# EasyEDA Pro project 四轮车板子.epro, board PCB2
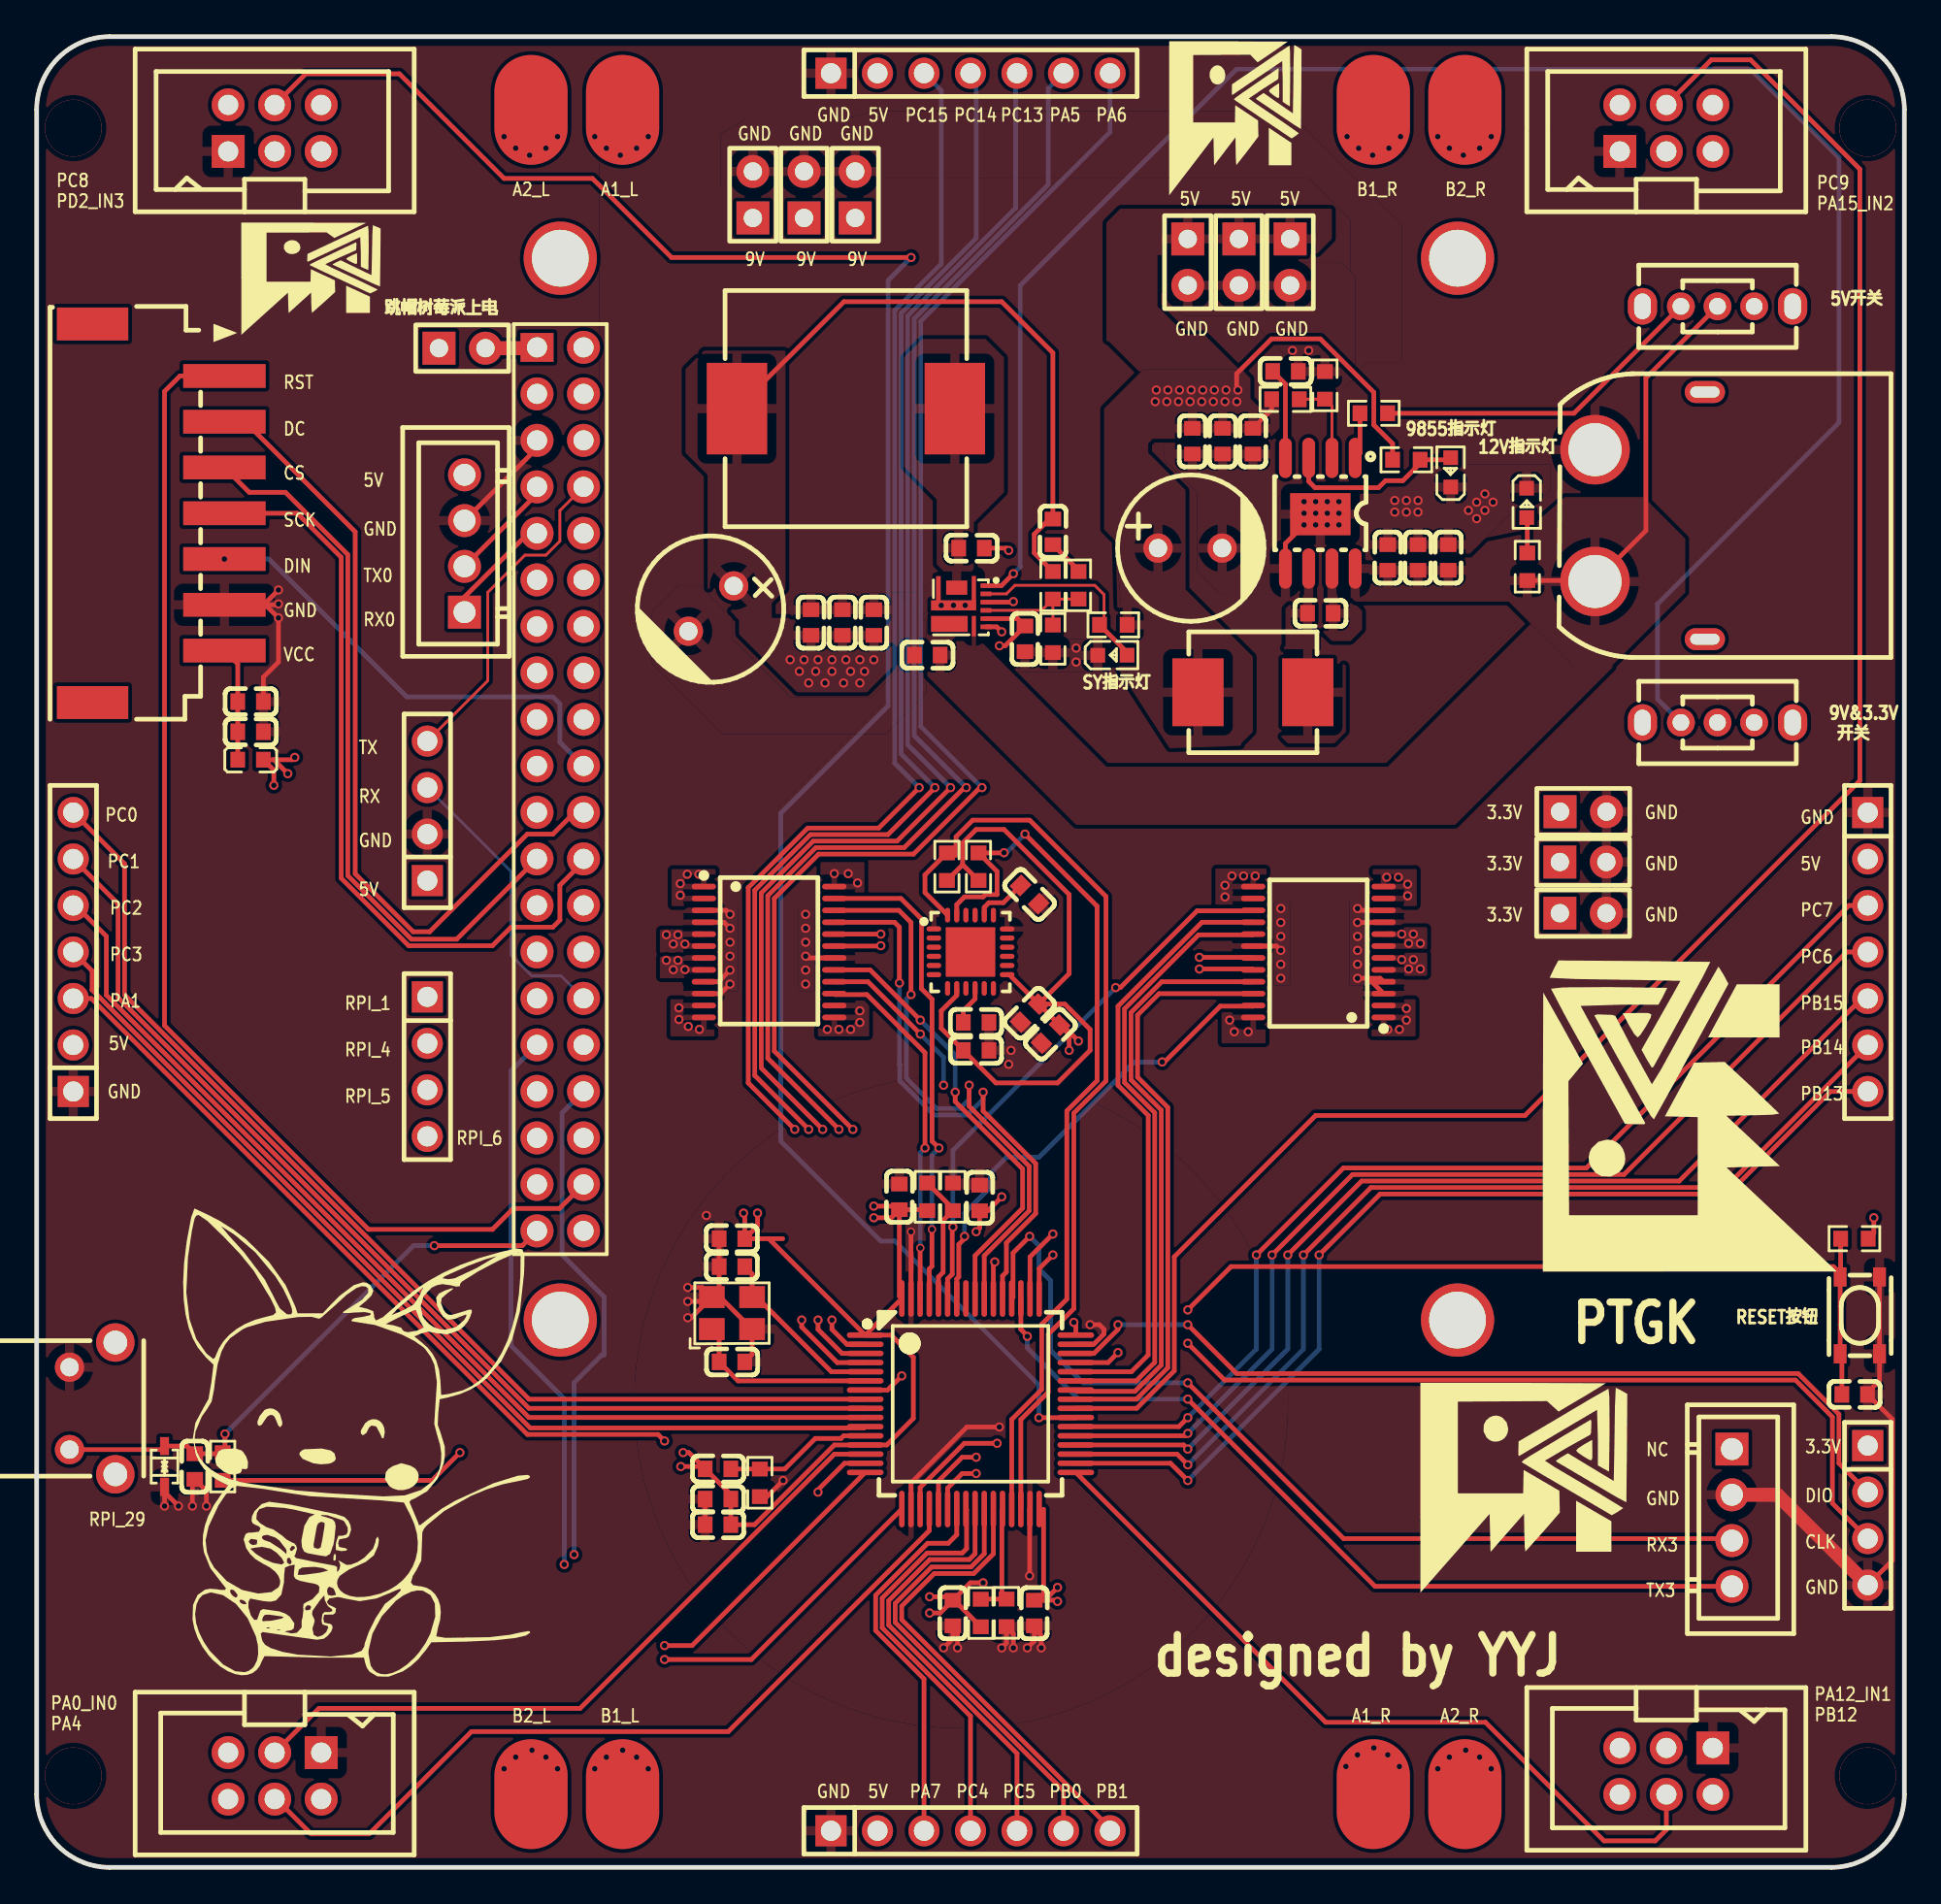
[diagram p10: board, top side]
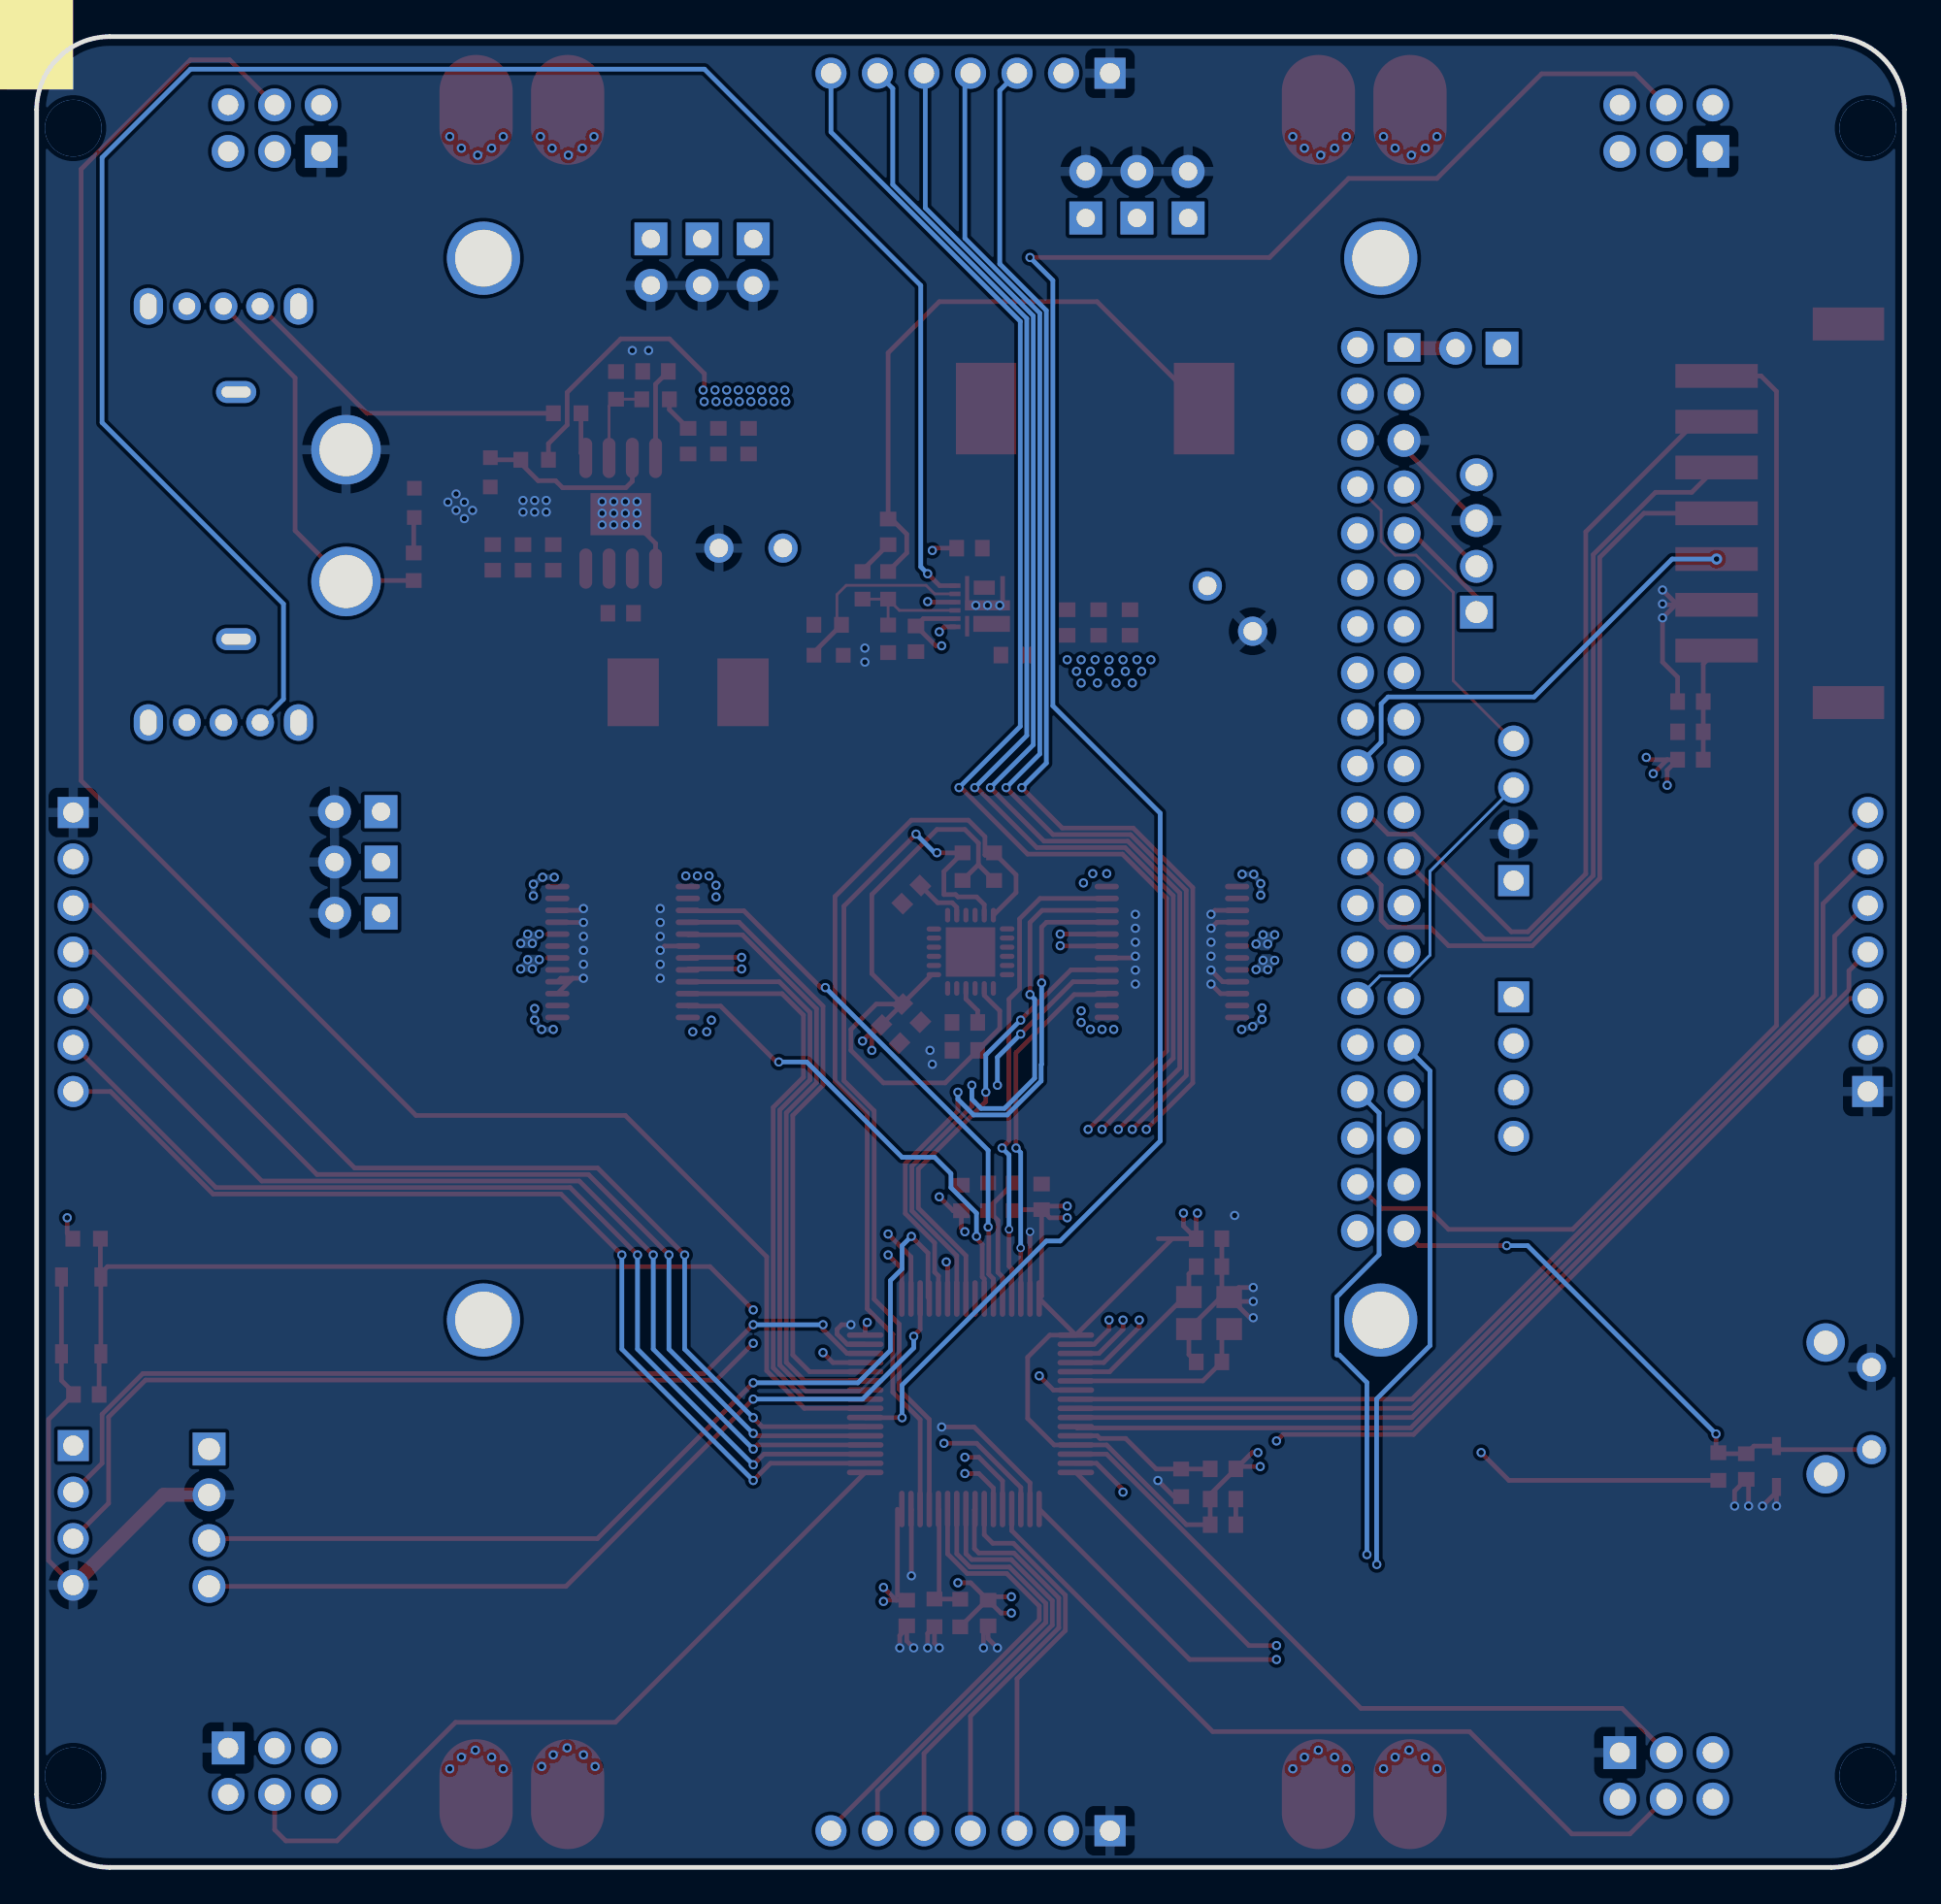
[diagram p11: board, bottom side, seen from below]

Outline 102 x 100 mm; copper layers: Top Layer, Inner1, Inner2, Bottom Layer. Coordinates in mm from the lower left corner of the outline.
Outline path: 0,96 0,4 arc(1.17,1.17) 4,0 98,0 arc(100.83,1.17) 102,4 102,96 arc(100.83,98.83) 98,100 4,100 arc(1.17,98.83) 0,96
Stack: Top Layer 0.035mm / Dielectric1 0.48mm PP er 4.5 / Inner1 0.035mm / Dielectric2 0.48mm FR4 er 4.5 / Inner2 0.035mm / Dielectric3 0.48mm PP er 4.5 / Bottom Layer 0.035mm

## Design rules (mm)
template: 自定义配置
spacing copperThickness1oz (default): track to track 0.102, other pairs 0.152 to 0.3
spacing copperThickness2oz: track to track 0.203, other pairs 0.152 to 0.3
track width copperThickness1oz (default): min 0.127, default 0.254, max 2.54
track width copperThickness2oz: min 0.203, default 0.254, max 2.54
differential pair differentialPair (default): width min 0.127, default 0.254, max 2.54; gap min 0.152, default 0.152
via viaSize (default): diameter min 0.45, default 0.61, max 10; hole min 0.3, default 0.305, max 6.3

## Placement (name value [footprint] x y rotation side)
C7  0.1u  [C0603]  8.64 21.9 90 top
C9  100nF  [C0603]  68.2 81.71 180 top
C10  22uF  [C0603]  75.44 71.55 90 top
C11  22uF  [C0603]  77.09 71.55 90 top
C12  100nF  [C0603]  73.79 71.55 90 top
C13  100nF  [C0603]  70.1 68.5 180 top
C15  22uF  [C0603]  64.77 77.9 90 top
C16  22uF  [C0603]  66.42 77.9 90 top
C17  0.1uF  [C0603]  63.12 77.9 90 top
C18  2.2μF  [C0603]  53.97 67.11 90 top
C19  10μF  [C0603]  48.64 66.22 180 top
C20  100nF  [C0603]  51.05 72.06 180 top
C21  220pF  [C0603]  55.5 72.95 270 top
C22  22μF  [C0603]  42.29 68 90 top
C23  22μF  [C0603]  45.72 68 90 top
C24  22μF  [C0603]  44 68 90 top
C26  220uF  [CAP-TH_BD8.0-P3.50-D0.6-FD]  36.83 68.76 225 top
C27  220uF  [CAP-TH_BD8.0-P3.50-D0.6-FD]  62.99 72.06 0 top
C29  100n  [C0603]  11.68 62.03 180 top
C30  10u  [C0603]  11.68 63.68 180 top
C31  100nF  [C0603]  51.31 44.63 0 top
C32  100nF  [C0603]  51.31 46.15 0 top
C33  2.2uF  [C0603]  54.23 53.14 315 top
C34  2.2uF  [C0603]  55.37 45.52 45 top
C35  100nF  [C0603]  54.23 46.66 45 top
C43  0.1u  [C0603]  37.97 34.34 0 top
C44  0.1u  [C0603]  50.04 13.89 90 top
C45  0.1u  [C0603]  54.48 13.89 90 top
C46  0.1u  [C0603]  51.5 36.56 270 top
C47  0.1u  [C0603]  47.12 36.63 270 top
C51  0.1u  [C0603]  99.29 25.83 0 top
C52  10p  [C0603]  37.97 32.82 0 top
C53  10p  [C0603]  37.97 27.61 180 top
C56  0.1u  [C0603]  37.21 21.77 180 top
C57  100nF  [C0603]  37.21 18.72 180 top
C58  10u  [C0603]  37.21 20.12 180 top
CN1  X8821WRS-07-9TSN  [CONN-SMD_X8821WRS-07-9TSN]  6.66 73.97 270 top
CN2  XT60PW-M  [CONN-TH_XT60PW-M]  88.1 73.84 180 top
CN3  XH-4A  [CONN-TH_4P-P2.50_XH-4A]  23.37 72.31 90 top
CN4  BH254V-6P  [IDC-TH_6P-P2.54-V-R2-C3-S2.54]  13 95 0 top
CN5  BH254V-6P  [IDC-TH_6P-P2.54-V-R2-C3-S2.54]  13 5 180 top
CN6  BH254V-6P  [IDC-TH_6P-P2.54-V-R2-C3-S2.54]  89 95 0 top
CN7  BH254V-6P  [IDC-TH_6P-P2.54-V-R2-C3-S2.54]  89 5.25 180 top
CN8  XH-4A  [CONN-TH_4P-P2.50_XH-4A]  92.58 19.1 270 top
D1  SD03C  [SOD-323_L1.8-W1.3-LS2.5-BI]  6.98 21.9 270 top
H1  -  [HDR-TH_2P-P2.54-V-M-1]  62.87 87.68 270 top
H2  -  [HDR-TH_2P-P2.54-V-M-1]  65.66 87.68 270 top
H3  -  [HDR-TH_2P-P2.54-V-M-1]  68.45 87.68 270 top
H4  -  [HDR-TH_2P-P2.54-V-M-1]  84.46 57.67 0 top
H5  -  [HDR-TH_2P-P2.54-V-M-1]  84.46 54.92 0 top
H6  -  [HDR-TH_2P-P2.54-V-M-1]  84.46 52.12 0 top
H7  2.54mm2*20P直排针  [HDR-TH_40P-P2.54-V-M-R2-C20-S2.54]  28.6 58.9 270 top
H8  -  [HDR-TH_2P-P2.54-V-M-1]  39.12 91.36 90 top
H9  -  [HDR-TH_2P-P2.54-V-M-1]  41.91 91.36 90 top
H10  -  [HDR-TH_2P-P2.54-V-M-1]  44.7 91.36 90 top
H24  -  [HDR-TH_7P-P2.54-V-M]  51 98 0 top
H25  -  [HDR-TH_7P-P2.54-V-M]  2 50 90 top
H26  -  [HDR-TH_7P-P2.54-V-M]  100 50 270 top
H27  -  [HDR-TH_7P-P2.54-V-M]  51 2 0 top
H28  -  [HDR-TH_2P-P2.54-V-M-1]  23.24 82.98 0 top
H29  -  [HDR-TH_4P-P2.54-V-M]  100 19.23 270 top
H30  -  [HDR-TH_4P-P2.54-V-M]  21.34 43.74 270 top
L1  3.3uH  [IND-SMD_L7.0-W6.6]  66.42 64.19 180 top
L2  1.5uH  [IND-SMD_L13.2-W12.9]  44.2 79.68 0 top
L4  600Ω  [L0603]  11.68 60.5 180 top
LED1  -  [LED_0603]  77.22 76.25 90 top
LED2  -  [LED_0603]  58.8 66.22 0 top
LED4  -  [LED_0603]  81.38 74.48 270 top
NOREF  -  [Pad_e91]  77.6 87.9 180 top
NOREF#2  -  [Pad_e93]  28.6 29.9 90 top
NOREF#3  -  [Pad_e46]  32 96 90 top
NOREF#4  -  [Pad_e45]  73 96 90 top
NOREF#5  -  [Pad_e41]  27 4 90 top
NOREF#6  -  [Pad_e47]  27 96 90 top
NOREF#7  -  [Pad_e95]  77.6 29.9 270 top
NOREF#8  -  [Pad_e42]  32 4 90 top
NOREF#9  -  [Pad_e40]  78 4 90 top
NOREF#10  -  [Pad_e38]  73 4 90 top
NOREF#11  -  [Pad_e89]  28.6 87.9 270 top
NOREF#12  -  [Pad_e44]  78 96 90 top
R7  100K  [R0603]  73.03 79.43 180 top
R8  118K  [R0603]  68.2 80.19 180 top
R9  20.5K  [R0603]  70.36 80.95 270 top
R10  4.7K  [R0603]  74.8 76.89 0 top
R11  4.7K  [R0603]  51.44 54.66 270 top
R12  0  [R0603]  39.5 21.01 270 top
R13  4.7K  [R0603]  58.8 67.87 180 top
R14  1K  [R0603]  56.9 70.03 270 top
R15  140K  [R0603]  55.5 70.03 270 top
R16  10K  [R0603]  55.5 67.11 270 top
R22  10k  [R0603]  10.16 21.9 270 top
R23  4.7K  [R0603]  49.71 54.66 270 top
R24  10K  [R0603]  81.41 71.04 90 top
R52  10k  [R0603]  99.27 34.34 180 top
R57  NC  [R0603]  48.64 36.63 270 top
R58  NC  [R0603]  51.56 13.89 270 top
R59  10k  [R0603]  50.04 36.63 270 top
R60  10k  [R0603]  52.97 13.9 90 top
SW9  KAN0637-0701B  [SW-TH_KAN0637-0701B]  3.05 25.07 270 top
SW10  SS12D07L3B  [SW-TH_SS-12D07-X-X]  91.8 62.53 180 top
SW11  SS12D07L3B  [SW-TH_SS-12D07-X-X]  91.8 85.27 180 top
SW12  -  [SW-SMD_4P-L4.2-W3.4-P2.15-LS4.5-TL]  99.57 30.15 270 top
U3  STM32F103RCT6  [LQFP-64_L10.0-W10.0-P0.50-LS12.0-BL]  51 25.32 270 top
U5  FR9855SP  [SOIC-8_L4.9-W3.9-P1.27-LS6.0-BL-EP3.3]  70.1 73.97 180 top
U6  SY8368QNC  [QFN-10_L3.0-W3.0-P0.45-TL_SILERGY]  50.55 68.89 270 top
U9  TB6612FNG,C,8,EL  [SSOP-24_L8.3-W5.6-P0.65-LS7.6-BL]  40 50 270 top
U10  MPU-6050  [QFN-24_L4.0-W4.0-P0.50-BL-EP2.7]  51 50.01 270 top
U11  TB6612FNG,C,8,EL  [SSOP-24_L8.3-W5.6-P0.65-LS7.6-BL]  70 50 90 top
UART1  -  [HDR-TH_4P-P2.54-V-F]  21.34 57.71 90 top
X2  8MHz  [OSC-SMD_4P-L3.2-W2.5-BL]  37.97 30.28 0 top

## Footprints (pads in the part's own frame, mm; a bottom-side part is the same pattern mirrored in y, then rotated)
C0603
  rect 0.8x0.9 smd: 1(-0.7,0) 2(0.7,0)
CAP-TH_BD8.0-P3.50-D0.6-FD
  round 1.6 hole 1: 1(-1.75,0) 2(1.75,0)
CONN-SMD_X8821WRS-07-9TSN
  rect 1.3x4.5 smd: 1(-7.5,3.6) 2(-5,3.6) 3(-2.5,3.6) 4(0,3.6) 5(2.5,3.6) 6(5,3.6) 7(7.5,3.6)
  rect 1.8x3.9 smd: 8(10.34,-3.6) 9(-10.34,-3.6)
CONN-TH_4P-P2.50_XH-4A
  rect 1.8x1.8 hole 1.199: 1(-3.751,0)
  round 1.8 hole 1.199: 2(-1.25,0) 3(1.25,0) 4(3.751,0)
CONN-TH_XT60PW-M
  round 3.8 hole 2.9: 1(3,-3.6) 2(3,3.6)
  oval 2.2x1.2 hole 1.6x0.6: 3(-3,6.75) 4(-3,-6.75)
HDR-TH_2P-P2.54-V-M-1
  rect 1.8x1.8 hole 1: 1(-1.27,0)
  round 1.8 hole 1: 2(1.27,0)
HDR-TH_4P-P2.54-V-F
  rect 1.7x1.7 hole 1.1: 1(-3.81,0)
  round 1.7 hole 1.1: 2(-1.27,0) 3(1.27,0) 4(3.81,0)
HDR-TH_4P-P2.54-V-M
  rect 1.7x1.7 hole 1.1: 1(-3.81,0)
  round 1.7 hole 1.1: 2(-1.27,0) 3(1.27,0) 4(3.81,0)
HDR-TH_7P-P2.54-V-M
  rect 1.7x1.7 hole 1.1: 1(-7.62,0)
  round 1.7 hole 1.1: 2(-5.08,0) 3(-2.54,0) 4(0,0) 5(2.54,0) 6(5.08,0) 7(7.62,0)
HDR-TH_40P-P2.54-V-M-R2-C20-S2.54
  rect 1.575x1.8 hole 1.1: 1(-24.13,-1.27)
  round 1.8 hole 1.1: 2(-24.13,1.27) 3(-21.59,-1.27) 4(-21.59,1.27) 5(-19.05,-1.27) 6(-19.05,1.27) 7(-16.51,-1.27) 8(-16.51,1.27) 9(-13.97,-1.27) 10(-13.97,1.27) 11(-11.43,-1.27) 12(-11.43,1.27) 13(-8.89,-1.27) 14(-8.89,1.27) 15(-6.35,-1.27) 16(-6.35,1.27) 17(-3.81,-1.27) 18(-3.81,1.27) 19(-1.27,-1.27) 20(-1.27,1.27) 21(1.27,-1.27) 22(1.27,1.27) 23(3.81,-1.27) 24(3.81,1.27) 25(6.35,-1.27) 26(6.35,1.27) 27(8.89,-1.27) 28(8.89,1.27) 29(11.43,-1.27) 30(11.43,1.27) 31(13.97,-1.27) 32(13.97,1.27) 33(16.51,-1.27) 34(16.51,1.27) 35(19.05,-1.27) 36(19.05,1.27) 37(21.59,-1.27) 38(21.59,1.27) 39(24.13,-1.27) 40(24.13,1.27)
IDC-TH_6P-P2.54-V-R2-C3-S2.54
  rect 1.8x1.8 hole 1.1: 1(-2.54,-1.27)
  round 1.8 hole 1.1: 2(-2.54,1.27) 3(0,-1.27) 4(0,1.27) 5(2.54,-1.27) 6(2.54,1.27)
IND-SMD_L7.0-W6.6
  rect 2.799x3.701 smd: 1(-2.999,0) 2(2.999,0)
IND-SMD_L13.2-W12.9
  rect 3.3x5 smd: 1(-5.95,0) 2(5.95,0)
L0603
  rect 0.8x0.864 smd: 1(-0.7,0) 2(0.7,0)
LED_0603
  rect 0.8x0.8 smd: 1(-0.851,-0.01) 2(0.75,-0.005)
LQFP-64_L10.0-W10.0-P0.50-LS12.0-BL
  oval 0.3x2 smd: 1(-3.75,-5.75) 2(-3.249,-5.75) 3(-2.75,-5.75) 4(-2.249,-5.75) 5(-1.75,-5.75) 6(-1.25,-5.75) 7(-0.75,-5.75) 8(-0.249,-5.75) 9(0.25,-5.75) 10(0.75,-5.75) 11(1.25,-5.75) 12(1.75,-5.75) 13(2.25,-5.75) 14(2.751,-5.75) 15(3.25,-5.75) 16(3.751,-5.75) 33(3.751,5.75) 34(3.25,5.75) 35(2.751,5.75) 36(2.25,5.75) 37(1.75,5.75) 38(1.25,5.75) 39(0.75,5.75) 40(0.25,5.75) 41(-0.249,5.75) 42(-0.75,5.75) 43(-1.25,5.75) 44(-1.75,5.75) 45(-2.249,5.75) 46(-2.75,5.75) 47(-3.249,5.75) 48(-3.75,5.75)
  oval 2x0.3 smd: 17(5.75,-3.75) 18(5.75,-3.25) 19(5.75,-2.75) 20(5.75,-2.25) 21(5.75,-1.75) 22(5.75,-1.25) 23(5.75,-0.75) 24(5.75,-0.25) 25(5.75,0.25) 26(5.75,0.75) 27(5.75,1.25) 28(5.75,1.75) 29(5.75,2.25) 30(5.75,2.75) 31(5.75,3.25) 32(5.75,3.75) 49(-5.75,3.75) 50(-5.75,3.25) 51(-5.75,2.75) 52(-5.75,2.25) 53(-5.75,1.75) 54(-5.75,1.25) 55(-5.75,0.75) 56(-5.75,0.25) 57(-5.75,-0.25) 58(-5.75,-0.75) 59(-5.75,-1.25) 60(-5.75,-1.75) 61(-5.75,-2.25) 62(-5.75,-2.75) 63(-5.75,-3.25) 64(-5.75,-3.75)
OSC-SMD_4P-L3.2-W2.5-BL
  rect 1.4x1.2 smd: 1(-1.1,-0.875) 2(1.1,-0.875) 3(1.1,0.875) 4(-1.1,0.875)
Pad_e38
  oval 6x4 smd: 1(0,0)
Pad_e40
  oval 6x4 smd: 1(0,0)
Pad_e41
  oval 6x4 smd: 1(0,0)
Pad_e42
  oval 6x4 smd: 1(0,0)
Pad_e44
  oval 6x4 smd: 1(0,0)
Pad_e45
  oval 6x4 smd: 1(0,0)
Pad_e46
  oval 6x4 smd: 1(0,0)
Pad_e47
  oval 6x4 smd: 1(0,0)
Pad_e89
  round 4 hole 3.1: 1(0,0)
Pad_e91
  round 4 hole 3.1: 1(0,0)
Pad_e93
  round 4 hole 3.1: 1(0,0)
Pad_e95
  round 4 hole 3.1: 1(0,0)
QFN-10_L3.0-W3.0-P0.45-TL_SILERGY
  rect 0.25x0.6 smd: 1(-1.125,1.3) 2(-0.675,1.3) 3(-0.225,1.3) 4(0.225,1.3) 5(0.675,1.3) 6(1.125,1.3)
  rect 1.12x0.225 smd: 7(1.088,0.637)
  rect 0.87x2 smd: 8(0.963,-0.7)
  rect 1.88x0.225 smd: 9(-0.712,0.637)
  rect 1.88x0.25 smd: 9(-0.708,-1.3)
  rect 0.555x2.45 smd: 9(-0.05,-0.475)
  rect 0.775x1.15 smd: 10(-1.015,-0.3)
QFN-24_L4.0-W4.0-P0.50-BL-EP2.7
  oval 0.28x0.8 smd: 1(-1.25,-2) 2(-0.75,-2) 3(-0.25,-2) 4(0.25,-2) 5(0.75,-2) 6(1.25,-2) 13(1.25,2) 14(0.75,2) 15(0.25,2) 16(-0.25,2) 17(-0.75,2) 18(-1.242,2)
  oval 0.8x0.28 smd: 7(2,-1.25) 8(2,-0.75) 9(2,-0.25) 10(2,0.25) 11(2,0.75) 12(2,1.25) 19(-2,1.25) 20(-2,0.75) 21(-2,0.25) 22(-2,-0.25) 23(-2,-0.75) 24(-2,-1.25)
  rect 2.7x2.7 smd: 25(0.013,0)
R0603
  rect 0.806x0.864 smd: 1(-0.753,0) 2(0.753,0)
SOD-323_L1.8-W1.3-LS2.5-BI
  rect 0.985x0.49 smd: 1(-1.117,0) 2(1.117,0)
SOIC-8_L4.9-W3.9-P1.27-LS6.0-BL-EP3.3
  oval 0.7x2.2 smd: 1(-1.905,-3.022) 2(-0.635,-3.022) 3(0.635,-3.022) 4(1.905,-3.022) 5(1.905,3.022) 6(0.635,3.022) 7(-0.635,3.022) 8(-1.905,3.022)
  rect 3.3x2.3 smd: 9(0,0.051)
SSOP-24_L8.3-W5.6-P0.65-LS7.6-BL
  oval 0.308x1.324 smd: 1(-3.575,-3.562) 2(-2.925,-3.562) 3(-2.275,-3.562) 4(-1.625,-3.562) 5(-0.975,-3.562) 6(-0.325,-3.562) 7(0.325,-3.562) 8(0.975,-3.562) 9(1.625,-3.562) 10(2.275,-3.562) 11(2.925,-3.562) 12(3.575,-3.562) 13(3.575,3.562) 14(2.925,3.562) 15(2.275,3.562) 16(1.625,3.562) 17(0.975,3.562) 18(0.325,3.562) 19(-0.325,3.562) 20(-0.975,3.562) 21(-1.625,3.562) 22(-2.275,3.562) 23(-2.925,3.562) 24(-3.575,3.562)
SW-SMD_4P-L4.2-W3.4-P2.15-LS4.5-TL
  rect 1.049x0.701 smd: 1(-2.1,1.075) 2(2.1,1.075) 3(-2.1,-1.075) 4(2.1,-1.075)
SW-TH_KAN0637-0701B
  round 1.6 hole 1: 1(-2.25,-1.25) 2(2.25,-1.25)
  round 2.1 hole 1.3: 3(-3.6,1.25) 4(3.6,1.25)
SW-TH_SS-12D07-X-X
  round 1.524 hole 0.914: 1(-2,0) 2(0,0) 3(2,0)
  oval 1.6x2 hole 0.9x1.4: EH(-4.1,0) EH(4.1,0)

## Nets
As in the schematic, except:
A1_L: NOREF#3.1 U9.1 U9.2
A1_R: NOREF#10.1 U11.1 U11.2
A2_L: NOREF#6.1 U9.5 U9.6
A2_R: NOREF#9.1 U11.5 U11.6
B1_L: NOREF#8.1 U9.11 U9.12
B1_R: NOREF#4.1 U11.11 U11.12
B2_L: NOREF#5.1 U9.7 U9.8
B2_R: NOREF#12.1 U11.7 U11.8

Pads without a net: CN1 8 9; CN2 3 4; CN4 5 6; CN5 5 6; CN6 5 6; CN7 5 6; CN8 1; H7 2 3 4 6 10 12 13 14 16 18 19 25 26 27 28 29 32 33 35 36 37 40; NOREF 1; NOREF#2 1; NOREF#7 1; NOREF#11 1; SW9 3 4; SW10 1 EH; SW11 1 EH; U10 2 3 4 5 6 7 9 12 14 15 16 17 19 21 22

## Via types
v1: diameter 3.1, hole 3.1, Top Layer to Bottom Layer, 4 vias
v2: diameter 0.5, hole 0.3, Top Layer to Bottom Layer, 293 vias
v3: diameter 0.45, hole 0.3, Top Layer to Bottom Layer, 3 vias
v4: diameter 0.61, hole 0.305, Top Layer to Bottom Layer, 1 via

## Routing (per net, layer and track width the routed paths; a pad name or vN(x,y) marks a point on that pad's centre or on a via; arc(x,y) is an arc through that point)
AGND: length 8.1
  Top Layer w0.254: C56.1 37.92,21.76 R12.1 40.86,21.76 42.53,23.43 43.93,23.43 44.07,23.57 U3.12
GND: length 108.2
  Top Layer w0.254: 37.27,34.34 37.27,31.55 36.87,31.15 ; CN1.6 12.4,68.97 ; 12.4,68.97 v2(13.21,69.77) ; 12.4,68.97 12.49,68.97 ; 36.87,31.15 37.32,31.15 X2.2 39.07,28.01 C53.1 ; 36.87,31.15 36.63,30.91 ; 36.87,31.15 36.35,31.67 v2(35.56,31.67) ; C57.2 C58.2 ; U3.63 47.75,34.72 v3(47.75,34.72) ; 36.63,30.91 35.74,30.02 v2(35.56,30.02) ; 36.63,30.91 v2(35.56,30.91) ; C30.1 12.38,65.01 13.21,65.84 v2(13.21,68.25) 12.49,68.97 ; U9.4 37.54,51.62 v2(37.87,51.3) ; v2(40.77,21.13) 39.89,20.25 R12.2 ; v2(37.87,49.01) 37.23,48.38 U9.9 ; v2(72.14,51.61) 73.55,51.61 U11.9 ; 50.04,13.01 C44.1 ; 50.04,13.01 50.29,12.76 v2(50.29,11.99) ; 50.04,13.01 50.04,12.5 v2(49.53,11.99) ; v2(9.27,19.74) 9.27,20.56 C7.1 8.51,21.07 v2(8.51,19.74) ; 72.72,48.56 73.37,48.56 U11.4 ; 72.72,48.56 U11.3 ; 72.72,48.56 v2(72.14,48.56) ; v2(54.23,15.93) 54.23,19.55 U3.31 ; v2(42,49.77) 42.09,49.67 U9.18 ; 54.48,13.04 54.48,12.37 v2(54.1,11.99) ; 54.48,13.04 54.86,12.66 v2(54.86,11.99) ; 54.48,13.04 C45.1 ; 6.98,20.5 v2(6.98,19.74) ; 6.98,20.5 D1.2 ; 6.98,20.5 v2(7.75,19.74) ; v2(53.34,11.99) 53.34,12.78 52.97,13.15 52.97,12.25 v2(52.71,11.99) ; v2(57.53,29.64) 58.03,29.64 58.29,29.39 58.29,29.13 57.73,28.57 U3.47 ; U9.3 37.65,52.28 v2(37.87,52.06) ; U11.18 67.71,50.33 v2(67.94,50.09) ; v2(72.14,52.38) 72.24,52.28 U11.10 ; U3.18 47.75,21 50.8,24.05 v2(52.58,24.05) ; H7.5 27.33,77.52 CN3.3 ; H29.4 101.35,16.76 101.35,24.47 C51.2 99.99,25.94 100.64,26.59 SW12.2 SW12.1 ; v2(69.22,73.33) 68.2,72.31 U5.5 ; v2(13.21,69.01) 13.16,68.97 12.49,68.97 ; U9.10 37.34,47.72 v2(37.87,48.25)
  Top Layer w0.762: H29.4 95.07,20.35 CN8.2
  vias: v2(36.58,35.61) v2(37.87,50.53) v2(37.87,49.77) v2(42,52.06) v2(42,51.3) v2(42,50.53) v2(42,49.01) v2(42,48.25) v2(49.4,68.93) v2(50.07,68.93) v2(50.71,68.93) v2(53.09,43.87) v2(53.21,44.63) v2(56.77,66.6) v2(56.77,65.84) v2(67.94,52.38) v2(67.94,51.61) v2(67.94,50.85) v2(67.94,49.33) v2(67.94,48.56) v2(68.58,82.86) v2(69.22,74.6) v2(69.22,73.97) v2(69.47,82.86) v2(69.85,74.6) v2(69.85,73.97) v2(69.85,73.33) v2(70.49,74.6) v2(70.49,73.97) v2(70.49,73.33) v2(71.12,74.6) v2(71.12,73.97) v2(71.12,73.33) v2(72.14,50.85) v2(72.14,50.09) v2(72.14,49.33) v2(74.17,74.66) v2(74.17,74.03) v2(74.8,74.66) v2(74.8,74.03) v2(75.44,74.66) v2(75.44,74.03) v2(78.19,74.12) v2(78.64,74.57) v2(78.64,73.67) v2(79.09,75.02) v2(79.09,74.12) v2(79.54,74.57)
VCC_3.3V: length 283.6
  Top Layer w0.254: 54.99,14.85 54.99,19.56 ; 36.38,21.9 C56.2 37.91,20.37 C58.1 C57.1 39.21,18.72 43.56,23.07 U3.13 46.43,23.07 47.88,24.53 47.88,27.86 46.67,29.07 U3.1 ; 36.38,21.9 35.62,22.66 v2(35.31,22.66) ; 36.38,21.9 v2(35.18,21.9) ; v2(56.39,44.63) 56.39,45.49 55.87,46.01 ; v2(48.77,13.89) 49.34,13.89 C44.2 ; v2(100.33,35.48) 100.33,34.65 R52.1 ; U3.1 U3.64 47.12,31.21 47.12,35.93 ; U3.1 39.98,34.34 ; v2(56.9,45.14) 56.02,46.01 55.87,46.01 ; 47.12,35.93 48.59,35.93 R57.2 ; 47.12,35.93 46.93,36.12 v2(45.72,36.12) ; 47.12,35.93 46.67,35.48 v2(45.72,35.48) ; 39.98,34.34 40.75,34.34 ; 39.98,34.34 C43.2 ; v2(55.75,14.53) 55.69,14.59 55.06,14.59 ; U3.48 56.75,29.66 v2(56.64,29.77) ; C43.2 39.37,35.04 v2(39.37,35.74) ; C43.2 38.67,35.67 v2(38.61,35.74) ; R58.2 50.11,14.59 C44.2 ; R22.2 21.6,21.14 v2(23.11,22.66) ; 55.87,46.01 54.72,47.16 ; 54.72,47.16 56.39,48.82 56.39,53.14 52.83,56.69 51.31,56.69 50.57,55.95 50.57,54.78 ; 54.72,47.16 53.12,48.76 U10.13 ; 54.72,47.16 56.15,47.16 57.53,45.77 57.53,44.63 55.75,42.85 52.39,42.85 C31.1 49.4,45.83 49.4,46.79 50.25,47.63 U10.8 ; v2(52.58,66.73) 52.89,66.73 C18.2 53.57,68.21 U6.5 ; 55.06,14.59 v2(55.75,15.29) ; 55.06,14.59 C45.2 54.74,14.85 ; v2(52.45,23.16) 50.66,23.16 48.25,20.75 U3.19 ; U6.3 53.31,69.11 v2(53.34,69.14) ; v2(51.31,34.72) 51.5,34.91 C46.2 51.94,35.86 v2(52.71,36.63) ; C44.2 50.99,15.54 v2(51.69,15.54) ; C44.2 49.85,14.78 v2(48.77,14.78) ; 54.74,19.56 U3.32 ; R23.2 50.57,54.76 50.57,54.78 ; 50.57,54.78 R11.2
  Inner2 w0.254: v2(53.34,69.14) 52.07,67.87 52.07,67.23 v2(52.58,66.73) ; SW10.2 93.57,64.31 100.2,64.31 101.22,63.3 101.22,41.58 100.33,40.69 v2(100.33,35.48) 100.33,23.37 H29.1 ; v2(56.64,29.77) 56.64,30.02 51.94,34.72 v2(51.31,34.72) ; v2(51.69,15.54) 52.45,16.31 v2(52.45,23.16) ; 23.24,22.66 35.43,22.66 ; 72.64,41.33 59.69,41.33 v2(56.39,44.63) ; v2(56.9,45.14) 59.94,42.09 73.15,42.09 H6.1
  Inner2 w0.762: SW10.2 88.88,65.46 87.56,65.46 85.09,62.98 85.09,59.56 H4.1
VCC_5V: length 501.3
  Top Layer w0.254: R10.1 74.05,77.77 73.03,78.79 73.03,80.57 70.1,83.49 67.44,83.49 65.53,81.58 65.53,80.77 v2(65.6,80.7) ; v2(13.72,59.74) 12.95,60.5 ; 12.95,60.5 13.97,60.5 v2(14.1,60.63) ; 12.95,60.5 L4.1 12.95,59.93 v2(12.95,59.11) ; v2(63.5,49.07) 66.39,49.07 U11.20 ; C16.2 67.45,79.63 R8.2 ; v2(63.5,49.71) 66.29,49.71 ; v2(46.1,50.98) 46.1,50.97 U9.20 ; v2(46.1,50.34) 46.08,50.33 U9.19
  Inner2 w0.254: v2(46.1,50.34) 58.55,50.34 61.59,47.3 61.59,45.01 64.01,42.6 68.07,42.6 70.49,45.01 70.49,56.44 65.41,61.52 65.41,70.03 67.18,71.81 67.18,75.87 v2(62.99,80.06) ; v2(46.1,50.98) 59.06,50.98 62.23,47.8 62.23,45.26 64.39,43.1 67.44,43.1 69.72,45.39 69.72,55.55 64.52,60.76 64.52,70.16 66.04,71.68 66.04,76.38 v2(62.36,80.06) ; v2(61.09,80.06) 63.25,77.9 63.25,60.25 68.58,54.92 68.58,46.28 66.29,43.99 64.9,43.99 63.5,45.39 v2(63.5,49.07) ; v2(63.5,49.71) 62.99,49.71 62.74,49.45 62.74,45.39 64.52,43.61 66.68,43.61 68.96,45.9 68.96,55.17 63.63,60.5 63.63,78.16 v2(61.72,80.06)
  Inner2 w0.762: 47.73,96.19 58.42,96.19 H2.1 ; 47.73,96.19 19.18,96.19 17.65,97.71 11.9,97.71 CN4.2 ; 47.73,96.19 H24.2 ; CN5.2 16.87,3.73 18.8,5.65 18.8,28.12 H25.2 19.94,62.86 19.94,75.11 20.9,76.06 CN3.4 23.37,81.58 H28.1 23.88,84.89 29.84,84.89 36.19,91.24 36.19,93.27 37.72,94.79 57.02,94.79 H1.1 ; H3.1 68.45,93.78 70.95,96.27 CN6.2
  vias: v2(61.14,80.7) v2(61.78,80.7) v2(62.41,80.7) v2(63.05,80.7) v2(63.63,80.06) v2(63.68,80.7) v2(64.32,80.7) v2(64.26,80.06) v2(64.9,80.06) v2(64.95,80.7) v2(65.54,80.06)
VCC_9V: length 33.7
  Top Layer w0.254: R15.1 54.48,71.8 54.48,72.82 55.31,73.65 C21.1 55.5,82.73 52.71,85.52 44.09,85.52 L2.1
  vias: v2(41.15,65.96) v2(41.66,65.33) v2(41.91,65.96) v2(42.16,64.69) v2(42.54,65.33) v2(42.67,65.96) v2(43.05,64.69) v2(43.18,45.77) v2(43.43,65.96) v2(43.43,65.33) v2(43.56,54.28) v2(43.81,45.77) v2(44.07,64.69) v2(44.2,65.96) v2(44.32,54.28) v2(44.45,65.33) v2(44.45,45.77) v2(44.83,53.77) v2(44.96,65.96) v2(44.96,64.69) v2(44.96,46.79) v2(44.96,46.15) v2(45.21,65.33) v2(45.72,65.96) v2(64.9,53.64) v2(64.9,53.01) v2(65.15,46.28) v2(65.28,54.15) v2(65.41,45.64) v2(65.91,54.15) v2(66.17,45.64) v2(66.55,54.15)
VCC_12V: length 21.5
  Top Layer w0.254: R24.1 85.05,70.29 CN2.2 87.88,73.02 87.88,81.36 SW11.2
(no net):
  vias: v1(2,95) v1(2,5) v1(100,95) v1(100,5)
A1_L:
  vias: v2(30.48,94.54) v2(31.12,93.9) v2(31.88,93.52) v2(32.77,93.9) v2(33.4,94.54) v2(35.15,53.74) v2(35.15,53.1) v2(35.53,54.25) v2(36.17,54.25)
A1_R:
  vias: v2(71.5,5.51) v2(72.14,6.15) v2(73.03,6.53) v2(73.79,45.77) v2(73.79,6.15) v2(74.42,45.77) v2(74.42,5.51) v2(74.8,46.91) v2(74.8,46.28)
A2_L:
  vias: v2(25.53,94.54) v2(26.16,93.9) v2(26.92,93.52) v2(27.81,93.9) v2(28.45,94.54) v2(34.39,50.94) v2(34.77,50.44) v2(35.02,50.94) v2(35.41,50.44)
A2_R:
  vias: v2(74.55,49.58) v2(74.93,49.07) v2(75.18,49.58) v2(75.56,49.07) v2(76.52,5.38) v2(77.15,6.02) v2(78.04,6.4) v2(78.8,6.02) v2(79.44,5.38)
B1_L:
  vias: v2(30.48,5.38) v2(31.12,6.02) v2(32,6.4) v2(32.77,6.02) v2(33.4,5.38) v2(35.08,46.95) v2(35.08,46.31) v2(35.59,45.93) v2(36.19,45.77)
B1_R:
  vias: v2(71.56,94.54) v2(72.2,93.9) v2(72.96,93.52) v2(73.73,54.08) v2(73.85,93.9) v2(74.37,54.08) v2(74.49,94.54) v2(74.87,53.7) v2(74.87,53.07)
B2_L:
  vias: v2(25.53,5.38) v2(26.16,6.02) v2(27.05,6.4) v2(27.81,6.02) v2(28.45,5.38) v2(34.39,49.55) v2(34.77,49.04) v2(35.02,49.55) v2(35.41,49.04)
B2_R:
  vias: v2(74.55,50.98) v2(74.93,50.47) v2(75.18,50.98) v2(75.56,50.47) v2(76.52,94.54) v2(77.15,93.9) v2(77.91,93.52) v2(78.8,93.9) v2(79.44,94.54)
BOOT0: length 7.2
  Top Layer w0.254: R57.1 50.04,35.98 R59.2 49.5,35.34 49.5,32.51 49.25,32.25 U3.60
BOOT1: length 6.4
  Top Layer w0.254: R58.1 51.57,14.66 R60.2 52.71,14.91 52.71,19.54 U3.28
D0_LCD_DC: length 44.8
  Top Layer w0.254: 29.87,57.63 29.38,57.63 28.19,56.44 26.8,56.44 21.46,51.11 20.56,51.11 17.4,54.27 17.4,72.95 11.38,78.97 CN1.2
D1_LCD_RST: length 66.8
  Top Layer w0.254: CN1.1 7.83,81.47 6.98,80.62 6.98,45.98 18.12,34.85 24.89,34.85 26.03,35.99 28.55,35.99 29.87,37.31
D5_LCD_SCK: length 42.8
  Top Layer w0.254: CN1.4 14.23,73.97 16.64,71.56 16.64,54.03 20.32,50.34 24.89,50.34 25.91,51.36 28.19,51.36 28.57,51.74 28.57,53.64 29.87,54.94 29.87,55.09
D7_LCD_DIN: length 25.5
  Bottom Layer w0.254: v4(10.25,71.47) 12.68,71.47 20.22,63.93 28.19,63.93 28.57,63.55 28.57,61.46 29.87,60.17
D8_LCD_CS: length 39.8
  Top Layer w0.254: CN1.3 11.61,75.11 13.59,75.11 16.99,71.7 16.99,54.17 20.47,50.7 22.94,50.7 H7.23
FR_FB: length 4.8
  Top Layer w0.152: R8.1 68.96,80.2 R9.2 70.74,79.82 U5.2
FR_PG: length 10
  Top Layer w0.254: 69.47,76.99 69.47,75.71 69.82,75.36 73.28,75.36 73.66,75.74 74.61,75.74 75.75,76.89 ; 75.75,76.89 77.11,76.89 LED1.2 ; 75.75,76.89 R10.2
GPIO29_KEY: length 31.3
  Top Layer w0.254: v2(10.29,23.67) 10.29,22.78 R22.1 10.11,22.59 C7.2 8.22,23.01 D1.1 6.79,22.82 SW9.2 ; H7.39 26.52,33.96 v2(21.72,33.96)
  Bottom Layer w0.254: v2(21.72,33.96) 20.57,33.96 v2(10.29,23.67)
OS_8M_IN: length 9.8
  Top Layer w0.254: 39.07,31.4 39.07,32.42 C52.2 ; 39.07,31.4 43.4,27.07 U3.5 ; 39.07,31.4 X2.3
OS_8M_OUT: length 10.4
  Top Layer w0.254: 36.87,29.4 37.27,29 37.27,27.61 38.31,26.57 U3.6
PA0_IN0: length 39
  Top Layer w0.254: U3.14 43.57,22.57 29.68,8.69 15.42,8.69 CN5.3
PA1_BACKUP4: length 55.9
  Top Layer w0.254: v2(42.67,20.5) 42.67,20.62 44.12,22.07 U3.15 ; H25.3 2.99,47.46 26.81,23.65 33.94,23.65 v2(34.29,23.29)
  Inner1 w0.254: v2(34.29,23.29) 35.18,24.18 38.99,24.18 v2(42.67,20.5)
PA2_UART2_TX: length 49.4
  Top Layer w0.254: U3.16 35.79,12.12 v2(34.29,12.12)
  Inner2 w0.254: v2(34.29,12.12) 34.29,12.15 v2(29.35,17.08)
  Bottom Layer w0.254: 29.87,42.39 28.69,41.21 28.69,33.47 30.99,31.17 30.99,27.99 30.86,27.99 29.35,26.48 v2(29.35,17.08)
PA3_UART2_RX: length 54.2
  Top Layer w0.254: U3.17 39.03,11.35 v2(34.29,11.35)
  Inner2 w0.254: v2(34.29,11.35) 33.91,11.35 28.81,16.45 v2(28.81,16.55)
  Bottom Layer w0.254: v2(28.81,16.55) 28.82,16.56 28.82,25.58 25.91,28.5 25.91,43.51 H7.31
PA4_INPUT16: length 44.6
  Top Layer w0.254: CN5.4 13.08,3.73 14.99,1.83 18.16,1.83 23.75,7.42 37.77,7.42 48.75,18.4 U3.20
PA5_INPUT17: length 99.5
  Top Layer w0.254: v2(43.81,40.31) 39.93,44.2 39.93,53.08 42.55,55.7 47.38,55.7 50.66,58.98 v2(50.77,58.98) ; v2(51.31,22.4) 50.55,22.4 49.25,21.11 U3.21
  Inner1 w0.254: v2(51.31,22.4) 53.22,22.4 53.72,22.91 53.72,24.06 43.94,33.84 43.94,40.18 v2(43.81,40.31)
  Bottom Layer w0.254: H24.6 55.25,97.16 55.25,91.92 47.93,84.6 47.93,61.82 v2(50.77,58.98)
PA6_INPUT18: length 100.7
  Top Layer w0.254: v2(51.63,58.98) 51.52,58.98 47.88,55.35 42.7,55.35 40.28,52.93 40.28,44.59 44.56,40.31 v2(44.58,40.31) ; U3.22 49.75,20.72 50.55,21.51 v2(51.31,21.51)
  Inner1 w0.254: v2(44.58,40.31) 44.68,40.21 44.68,33.6 54.08,24.21 54.08,22.76 52.83,21.51 v2(51.31,21.51)
  Bottom Layer w0.254: v2(51.63,58.98) 48.28,62.32 48.28,84.45 58.62,94.79 H24.7
PA7_INPUT10: length 21.2
  Top Layer w0.254: H27.3 48.46,10.3 45.82,12.94 45.82,14.87 48.66,17.7 49.78,17.7 50.25,18.17 U3.23
PA8_AIN2_R: length 32.5
  Top Layer w0.254: U3.41 60.06,25.57 61.77,27.29 61.77,41.51 60.12,43.17 60.12,46.55 61.29,47.72 U11.22
PA9_AIN1_R: length 32.6
  Top Layer w0.254: U11.21 61.44,48.38 59.77,46.7 59.77,43.02 61.42,41.37 61.42,27.44 59.98,26 56.82,26 U3.42
PA10_BIN1_R: length 33.4
  Top Layer w0.254: U11.17 66.4,50.94 63.46,50.94 59.41,46.89 59.41,42.87 61.06,41.22 61.06,27.59 60.05,26.57 U3.43
PA11_BIN2_R: length 33.4
  Top Layer w0.254: U11.16 63.64,51.62 59.05,47.04 59.05,42.72 60.71,41.07 60.71,27.99 59.79,27.07 U3.44
PA12_IN1: length 42.4
  Top Layer w0.254: v2(59.06,28.12) 58.51,27.57 U3.45
  Inner1 w0.254: v2(59.06,28.12) 59.43,27.74 69.47,27.74 89,8.21 CN7.3
PA15_IN2: length 79.2
  Top Layer w0.254: U3.50 54.25,33.35 v2(55.5,34.59)
  Inner1 w0.254: v2(55.5,34.59) 65.02,44.12 68.71,44.12 70.1,45.52 70.1,56.95 81.66,68.5 81.66,86.39 CN6.3
PB0_INPUT14: length 24.7
  Top Layer w0.254: U3.26 51.75,17.13 51.03,16.41 48.87,16.41 46.89,14.42 46.89,13.38 56.08,4.19 H27.6
PB1_INPUT15: length 25.6
  Top Layer w0.254: H27.7 58.62,2.15 47.24,13.53 47.24,14.28 49.02,16.05 51.18,16.05 52.25,17.13 U3.27
PB3_AIN2_L: length 32.2
  Top Layer w0.254: v2(50.93,42.72) 50.93,41.57 54.2,38.3 54.2,35.86 51.75,33.41 U3.55 ; v2(47.75,47.68) 47.75,51.61 47.09,52.28 U9.22
  Bottom Layer w0.254: v2(50.93,42.72) 50.93,41.96 50.42,41.45 49.15,41.45 47.5,43.1 47.5,47.42 v2(47.75,47.68)
PB4_BIN1_L: length 24.4
  Top Layer w0.254: v2(48.26,46.28) 45.51,49.03 U9.17 ; U3.56 51.25,33.41 53.85,36.01 53.85,38.15 50.16,41.83 v2(50.16,42.34)
  Bottom Layer w0.254: v2(48.26,46.28) 50.16,44.37 v2(50.16,42.34)
PB5_BIN2_L: length 9.2
  Top Layer w0.254: U9.16 45.4,48.38 v2(48.26,45.52)
  Bottom Layer w0.254: v2(48.26,45.52) 49.53,44.25 v2(49.53,42.72)
PB6_PMMA_R: length 25.7
  Top Layer w0.254: U11.23 66.4,47.04 64.64,47.04 61.59,43.99 v2(61.47,43.99) ; U3.58 50.25,32.14 50.36,32.25 50.36,34.03 50.67,34.34 v2(50.67,34.47)
  Bottom Layer w0.254: v2(50.67,34.47) 50.67,35.74 52.07,37.14 52.07,37.9 52.96,38.79 54.74,38.79 59.94,43.99 v2(61.47,43.99)
PB7_PMMB_R: length 30
  Top Layer w0.254: U11.15 66.41,52.25 63.37,52.25 59.18,48.06 v2(58.93,48.06) ; v2(50.04,34.98) 50,34.94 50,32.4 49.75,32.15 U3.59
  Bottom Layer w0.254: v2(58.93,48.06) 50.04,39.17 v2(50.04,34.98)
PB8_PMMA_L: length 26.6
  Top Layer w0.254: v3(48.9,34.85) 48.9,32.83 48.75,32.69 U3.61 ; U9.23 47.2,52.92 48.32,51.81 48.32,48 48.9,47.42 48.9,39.67 v2(49.28,39.29)
  Bottom Layer w0.254: v2(49.28,39.29) 48.9,38.91 v3(48.9,34.85)
PB9_PMMB_L: length 19.8
  Top Layer w0.254: v3(48.26,33.83) 48.25,33.82 U3.62 ; U9.15 43.61,47.68 45.34,47.68 48.51,44.5 v2(48.51,39.29)
  Bottom Layer w0.254: v3(48.26,33.83) 48.26,39.04 v2(48.51,39.29)
PB10_SCL: length 49.1
  Top Layer w0.254: v2(52.83,55.42) 52.82,55.41 R11.1 52.45,54.4 52.45,53.14 51.82,53.14 51.69,53.01 50.67,53.01 50.25,52.59 U10.23 ; U3.29 53.25,24.47 54.89,26.11 54.89,29.67 56.26,31.04 56.26,41.32 57.91,42.97 57.91,52.5 v2(53.97,56.44)
  Bottom Layer w0.254: v2(53.97,56.44) 52.96,55.42 v2(52.83,55.42)
PB11_SDA: length 51.7
  Top Layer w0.254: 49.59,55.29 50.2,55.29 50.21,55.3 50.21,56.29 51.12,57.2 54.23,57.2 58.4,53.03 58.4,42.96 56.64,41.2 56.64,30.52 55.25,29.12 55.25,25.96 53.75,24.46 U3.30 ; 49.59,55.29 R23.1 ; 49.59,55.29 48.51,54.22 48.51,53.25 U10.24
PB12_BACKUP0: length 42.8
  Top Layer w0.254: CN7.4 89,2.06 88.39,1.45 85.6,1.45 79.12,7.93 70.4,7.93 U3.33
PB13_BACKUP1: length 55.5
  Top Layer w0.254: H26.7 97.96,42.38 92.36,36.78 73.37,36.78 v2(70.04,33.45) ; v2(62.87,21.13) 61.92,22.07 U3.34
  Bottom Layer w0.254: v2(70.04,33.45) 70.04,28.31 v2(62.87,21.13)
PB14_BACKUP2: length 56
  Top Layer w0.254: H26.6 92.22,37.14 72.87,37.14 v2(69.18,33.45) ; v2(62.87,21.99) 62.28,22.57 U3.35
  Bottom Layer w0.254: v2(69.18,33.45) 69.18,28.31 v2(62.87,21.99)
PB15_BACKUP3: length 56.6
  Top Layer w0.254: H26.5 99.67,47.46 89.7,37.49 72.36,37.49 v2(68.33,33.45) ; U3.36 62.64,23.07 v2(62.87,22.85)
  Bottom Layer w0.254: v2(68.33,33.45) 68.33,28.31 v2(62.87,22.85)
PC0_INPUT0: length 60.7
  Top Layer w0.254: H25.7 4.8,54.82 4.8,47.66 26.89,25.57 U3.8
PC1_INPUT1: length 58.7
  Top Layer w0.254: H25.6 4.44,52.64 4.44,47.52 26.89,25.07 U3.9
PC2_INPUT2: length 56.7
  Top Layer w0.254: H25.5 2.13,52.54 3.81,50.86 3.81,47.65 26.88,24.57 U3.10
PC3_INPUT3: length 54.7
  Top Layer w0.254: U3.11 45.18,24 26.95,24 3.03,47.93 3.03,48.97 H25.4
PC4_INPUT4: length 22.6
  Top Layer w0.254: H27.4 51,8.26 46.18,13.09 46.18,14.72 48.63,17.17 50.55,17.17 50.79,17.41 50.79,19.54 U3.24
PC5_INPUT5: length 23.7
  Top Layer w0.254: U3.25 51.25,17.13 50.93,16.81 48.78,16.81 46.53,14.57 46.53,13.23 53.54,6.22 H27.5
PC6_INPUT6: length 57.2
  Top Layer w0.254: H26.4 98.84,50 86.69,37.85 71.86,37.85 v2(67.47,33.45) ; v2(62.87,23.7) 62.73,23.57 U3.37
  Bottom Layer w0.254: v2(62.87,23.7) 67.47,28.31 v2(67.47,33.45)
PC7_INPUT7: length 58.1
  Top Layer w0.254: v2(66.61,33.45) 71.36,38.2 84.63,38.2 98.97,52.54 H26.3 ; U3.38 62.38,24.07 v2(62.87,24.56)
  Bottom Layer w0.254: v2(62.87,24.56) 66.61,28.31 v2(66.61,33.45)
PC8_INPUT8: length 114.2
  Top Layer w0.254: U3.39 56.74,24.56 v2(54.74,24.56) ; v2(47.75,87.94) 34.67,87.94 30.35,92.25 25.53,92.25 19.81,97.97 14.7,97.97 CN4.4
  Bottom Layer w0.254: v2(54.74,24.56) 54.74,26.34 46.86,34.21 46.1,34.21 40.64,39.67 40.64,57.58 46.5,63.44 46.5,86.69 v2(47.75,87.94)
PC9_INPUT9: length 108.1
  Top Layer w0.254: U3.40 60.07,25.07 62.13,27.13 62.13,33.35 69.85,41.07 81.28,41.07 99.57,59.36 99.57,92.76 93.6,98.73 91.46,98.73 CN6.4
PC12_AIN1_L: length 31.3
  Top Layer w0.254: U9.21 46.85,51.62 47.12,51.36 v2(47.12,48.31) ; v2(51.69,42.34) 51.69,41.32 54.56,38.44 54.56,35.72 52.96,34.11 52.96,32.52 52.75,32.31 U3.53
  Bottom Layer w0.254: v2(51.69,42.34) 51.69,41.96 50.82,41.1 49,41.1 47.14,42.96 47.14,43.84 47.12,43.87 v2(47.12,48.31)
PC13_INPUT11: length 82.8
  Top Layer w0.254: v2(49.91,58.98) 46.99,56.06 42.41,56.06 39.57,53.22 39.57,43.66 v2(42.93,40.31) ; v2(43.43,29.9) 43.43,29.39 44.25,28.57 U3.2
  Inner1 w0.254: v2(42.93,40.31) 43.43,39.8 v2(43.43,29.9)
  Bottom Layer w0.254: H24.5 53.47,97.93 53.47,90.64 47.57,84.75 47.57,61.32 v2(49.91,58.98)
PC14_INPUT12: length 82.3
  Top Layer w0.254: v2(42.16,40.31) 39.22,43.26 39.22,53.37 42.26,56.41 46.49,56.41 v2(49.05,58.98) ; v2(42.67,29.9) 42.67,29.39 43.99,28.07 U3.3
  Inner1 w0.254: v2(42.67,29.9) 42.67,39.8 v2(42.16,40.31)
  Bottom Layer w0.254: H24.4 51.31,97.69 51.31,88.99 47.21,84.89 47.21,60.82 v2(49.05,58.98)
PC15_INPUT13: length 82.1
  Top Layer w0.254: v2(41.4,40.31) 38.86,42.85 38.86,53.52 42.11,56.77 45.99,56.77 v2(48.2,58.98) ; v2(41.78,29.9) 41.78,29.51 43.72,27.57 U3.4
  Inner1 w0.254: v2(41.4,40.31) 41.78,39.93 v2(41.78,29.9)
  Bottom Layer w0.254: H24.3 49.4,97.06 49.4,87.58 46.86,85.04 46.86,60.32 v2(48.2,58.98)
PD2_IN3: length 89.8
  Top Layer w0.254: v2(52.32,33.07) 52.25,33 U3.54
  Inner1 w0.254: v2(52.32,33.07) 52.07,33.33 52.07,38.02 46.61,43.48 42.67,43.48 41.02,45.14 41.02,64.69 33.02,72.69 33.02,88.19 28.83,92.38 14.35,92.38 CN4.3
RESET: length 64.8
  Top Layer w0.254: v2(47.24,26.85) 46.47,26.07 U3.7 ; 98.52,32.42 R52.2 ; 98.52,32.42 98.12,32.82 65.23,32.82 v2(62.87,30.45) ; 98.52,32.42 98.52,32.28 SW12.3 SW12.4 98.59,27.96 C51.1
  Inner2 w0.254: v2(47.24,26.85) 59.18,26.85 62.79,30.45 v2(62.87,30.45)
RPI_GPIO1_BACKUP0: length 25.3
  Inner2 w0.254: H30.1 24.26,50.47 24.26,67.26 H7.11
RPI_GPIO4_BACKUP1: length 22.7
  Inner2 w0.254: H7.15 24.64,62.56 24.64,48.76 21.34,45.45 H30.2
RPI_GPIO5_BACKUP2: length 22.7
  Inner2 w0.254: 21.34,42.47 21.34,43.41 25.15,47.22 25.15,60.53 H7.17
RPI_GPIO6_BACKUP3: length 20.2
  Inner2 w0.254: H30.4 25.91,44.5 25.91,56.21 H7.21
RPI_RX: length 16
  Bottom Layer w0.152: UART1.3 25.91,54.41 25.91,49.83 27.05,48.69 28.64,48.69 29.87,47.47
RPI_TX: length 18.1
  Top Layer w0.152: UART1.4 24.64,64.82 24.64,69.65 26.67,71.68 27.81,71.68 28.57,72.44 28.57,74.11 29.87,75.41
RX0: length 6.2
  Top Layer w0.254: H7.9 26.84,72.87 23.37,69.4 CN3.1
SWCLK: length 56.4
  Top Layer w0.254: H29.3 98.07,19.89 98.07,24.6 96.05,26.62 64.87,26.62 v2(62.87,28.63) ; v2(55.5,33.45) 54.75,32.7 U3.49
  Inner1 w0.254: v2(62.87,28.63) 58.04,33.45 v2(55.5,33.45)
SWDIO: length 49.4
  Top Layer w0.254: H29.2 98.43,22.07 98.43,24.75 96.2,26.97 65.53,26.97 v2(62.87,29.64) ; U3.46 57.74,28.07 59.06,29.39 v2(59.06,29.64)
  Bottom Layer w0.254: v2(59.06,29.64) v2(62.87,29.64)
SY_BS: length 7.8
  Top Layer w0.254: v2(52.71,67.49) 52.43,67.76 U6.6 ; C20.1 52.96,72.06 v2(53.09,71.93)
  Inner2 w0.254: v2(53.09,71.93) 54.1,70.92 54.1,68.89 v2(52.71,67.49)
SY_FB: length 6.7
  Top Layer w0.152: R16.1 R15.2 ; R15.2 R14.2 ; R15.2 54.88,68.66 U6.4
SY_PG: length 10.9
  Top Layer w0.152: R13.2 58.29,68.11 58.29,69.52 57.78,70.03 53.43,70.03 52.96,69.56 U6.2
  Top Layer w0.254: R13.2 59.55,66.37 59.55,66.21
TX0: length 6
  Top Layer w0.254: CN3.2 27.33,75.02 H7.7
UART3_RX: length 52
  Top Layer w0.254: v2(54.23,34.47) 53.32,33.56 53.32,31.14 U3.52 ; v2(62.87,26.47) 71.37,17.96 92.48,17.96 CN8.3
  Bottom Layer w0.254: v2(62.87,26.47) 57.15,26.47 55.37,28.25 55.37,32.06 54.74,32.69 54.74,33.96 v2(54.23,34.47)
UART3_TX: length 46.7
  Top Layer w0.254: v2(62.87,25.58) 73.09,15.35 CN8.4 ; U3.51 53.75,29.39 54.1,29.04 v2(54.1,29.01)
  Bottom Layer w0.254: v2(62.87,25.58) 56.9,25.58 54.1,28.37 v2(54.1,29.01)
$2N1181: length 2.5
  Top Layer w0.254: R7.2 72.27,77.25 U5.1
$2N1291: length 5
  Top Layer w0.254: C9.2 68.2,81.02 U5.4
$2N15773: length 104.8
  Top Layer w0.254: U6.1 52.69,70.01 v2(53.34,70.66)
  Bottom Layer w0.254: v2(53.34,70.66) 53.72,71.04 53.72,86.41 65.53,98.22 93.6,98.22 98.43,93.4 98.43,78.92 88.52,69.01 88.52,63.81 SW10.3
$2N17130: length 2
  Top Layer w0.254: C21.2 56.9,70.85 R14.1
$2N18130: length 1.9
  Top Layer w0.254: LED4.2 81.41,73.7 R24.2
$2N20270: length 18.4
  Top Layer w0.254: R7.1 83.95,79.43 SW11.3
$4N577: length 6.3
  Top Layer w0.254: L4.2 C29.2 C30.2 10.98,65.74 CN1.7
$4N3144: length 2.8
  Top Layer w0.762: H28.2 27.28,82.98 H7.1
$5N1404: length 2.1
  Top Layer w0.254: C32.1 50.61,46.79 51.25,47.44 U10.10
$5N1517: length 2.9
  Top Layer w0.254: U10.20 51.75,52.44 52,52.69 52.79,52.69 C33.1

## Copper pours and planes (outline as drawn; the poured copper is in the pictures)
GND on Top Layer: -8.76,110.54 113.16,110.54 113.16,-8.08 -8.76,-8.08
GND on Top Layer: 41.62,67.99 41.02,68.59 41.02,69.01 41.66,69.65 47.12,69.65 48.59,68.04 48.59,64.14 46.35,61.9 37.47,61.9 33.6,65.76 33.6,68.58 35.05,70.03 36.19,70.03 37.97,68.25 37.97,67.11 41.15,63.93 45.59,63.93 47.12,65.46 47.12,67.87 41.74,67.87 41.62,67.99
GND on Top Layer: 46.86,69.65 48.26,69.65 49.15,70.54 49.15,69.01 49.53,68.63 48.64,68.63 48.26,68.25
GND on Top Layer: 37.42,52.44 38.31,52.44 38.31,47.87 37.42,47.87
GND on Top Layer: 53.27,67.1 58.7,67.1 58.7,65.3 53.27,65.3
GND on Top Layer: 67.82,74.85 67.82,72.69 67.94,72.57 67.94,72.44 72.26,72.44 73.03,71.68 78.23,71.68 80.63,74.08 80.63,74.58 82.02,74.58 82.68,75.23 82.68,76.63 78.01,76.63 77.53,76.15 73.21,76.15 72.6,75.54 68.5,75.54
GND on Top Layer: 68.34,25.86 68.3,26.69 68.22,27.51 68.11,28.32 67.96,29.14 67.77,29.94 67.54,30.73 67.28,31.51 66.98,32.28 66.65,33.04 66.28,33.77 65.88,34.5 65.45,35.2 64.98,35.88 64.49,36.53 63.96,37.17 63.4,37.78 62.82,38.36 62.21,38.92 61.58,39.44 60.92,39.94 60.24,40.41 59.54,40.84 58.82,41.24 58.08,41.61 57.32,41.94 56.55,42.24 55.77,42.5 54.98,42.73 54.18,42.92 53.37,43.07 52.55,43.18 51.73,43.26 50.9,43.3 50.08,43.3 49.26,43.26 48.43,43.18 47.62,43.07 46.81,42.92 46,42.73 45.21,42.5 44.43,42.24 43.66,41.94 42.91,41.61 42.17,41.24 41.45,40.84 40.75,40.41 40.07,39.94 39.41,39.44 38.77,38.92 38.16,38.36 37.58,37.78 37.03,37.17 36.5,36.53 36,35.88 35.54,35.2 35.1,34.5 34.7,33.77 34.33,33.04 34,32.28 33.7,31.51 33.44,30.73 33.21,29.94 33.03,29.14 32.87,28.32 32.76,27.51 32.68,26.69 32.65,25.86 32.65,25.04 32.68,24.21 32.76,23.39 32.87,22.58 33.03,21.77 33.21,20.96 33.44,20.17 33.7,19.39 34,18.62 34.33,17.87 34.7,17.13 35.1,16.41 35.54,15.71 36,15.03 36.5,14.37 37.03,13.73 37.58,13.12 38.16,12.54 38.77,11.98 39.41,11.46 40.07,10.96 40.75,10.49 41.45,10.06 42.17,9.66 42.91,9.29 43.66,8.96 44.43,8.66 45.21,8.4 46,8.17 46.81,7.98 47.62,7.83 48.43,7.72 49.26,7.64 50.08,7.6 50.9,7.6 51.73,7.64 52.55,7.72 53.37,7.83 54.18,7.98 54.98,8.17 55.77,8.4 56.55,8.66 57.32,8.96 58.08,9.29 58.82,9.66 59.54,10.06 60.24,10.49 60.92,10.96 61.58,11.46 62.21,11.98 62.82,12.54 63.4,13.12 63.96,13.73 64.49,14.37 64.98,15.03 65.45,15.71 65.88,16.41 66.28,17.13 66.65,17.87 66.98,18.62 67.28,19.39 67.54,20.17 67.77,20.96 67.96,21.77 68.11,22.58 68.22,23.39 68.3,24.21 68.34,25.04
GND on Top Layer: 68.21,81.71 68.21,81.26 68.62,80.85 71.45,80.85 72.01,81.41 72.01,86.92 71.25,87.68 62.29,87.68 61.59,86.98 61.59,85.78 62.61,84.76 66.04,84.76 68.2,82.6 68.2,81.7
GND on Top Layer: 67.6,77.89 67.6,76.12 68.71,76.12 69.72,75.11 69.72,72.98 68.71,71.97 68.71,69.82 68.46,69.57 68.46,69.56 64.61,69.56 63.37,70.79 63.37,75.11 61.59,76.89 61.59,77.78 61.72,77.9 61.73,77.89
GND on Top Layer: 67.56,52.76 68.45,52.76 68.45,48.18 67.56,48.18
GND on Top Layer: 41.61,52.44 42.5,52.44 42.5,47.87 41.61,47.87
GND on Top Layer: 71.69,52.76 72.58,52.76 72.58,48.18 71.69,48.18
GND on Top Layer: 30.73,94.79 108.46,94.79 108.46,56.31 30.73,56.31
GND on Top Layer: 43.94,95.43 45.72,95.94 68.33,95.94 74.55,89.71 74.55,82.22 72.64,82.22 71.75,81.33 71.75,89.97 69.47,92.25 45.97,92.25 45.59,91.87 37.34,91.87 37.34,94.67 38.61,95.43
GND on Bottom Layer: -28.07,128.45 141.99,128.45 141.99,-24.59 -28.07,-24.59
GND on Inner1: -21.34,120.95 126.75,120.95 126.75,-19 -21.34,-19
VCC_3.3V on Inner2: 82.68,54.42 70.48,42.22 46.99,42.22 41.02,36.25 38.23,36.25 37.59,35.61 37.47,35.61 37.47,29.39 35.18,27.1 34.42,21.77 43.11,15.1 47.06,12.9 58.04,13.77 57.53,16.18 56.13,15.93 55.25,16.18 54.48,16.05 44.85,16.68 37.98,23.55 37.98,25.99 40,28.01 40,32.61 41.74,34.34 42.29,34.34 45.59,37.64 46.88,37.64 48.5,39.26 72.01,39.26 85.22,52.47 85.22,54.28 85.08,54.42
VCC_3.3V on Inner2: 45.21,39.8 63.75,39.8 63.75,28.37 45.21,28.37
VCC_3.3V on Inner2: 51.82,66.73 52.32,67.23 53.11,67.23 57.66,71.78 57.66,84.25 58.04,84.63 73.22,84.63 84.56,73.29 84.56,50.6 81.53,50.72 81.28,68.25 67.42,82.11 66.81,82.11 66.58,82.35 60.32,82.35 60.32,71.04 55.08,65.79 52.49,65.79 51.82,66.47
VCC_5V on Top Layer: 65.79,61.39 66.42,62.03 66.42,66.14 62.75,69.81 62.75,75.23 60.71,77.27 60.71,77.78 60.96,78.03 67.31,78.03 68.2,78.92 68.2,79.4 67.89,79.71 66.81,79.71 66.29,80.23 66.29,81.33 65.91,81.71 65.91,81.84 60.45,81.84 58.29,79.68 58.29,73.08 58.93,72.44 59.56,64.69 59.1,65.42 61.88,61.13 65.79,61.27
VCC_5V on Top Layer: 60.2,81.71 58.55,83.36 58.42,83.36 58.42,89.84 59.18,90.6 70.74,90.6 70.74,88.95 69.85,88.06 61.21,88.06 61.21,85.27 62.74,83.74 63.75,83.74 65.66,81.84 65.66,81.71
VCC_5V on Top Layer: 65.79,61.39 66.42,62.03 66.42,66.14 62.75,69.81 62.75,75.23 60.71,77.27 60.71,77.78 60.96,78.03 67.31,78.03 68.2,78.92 68.2,79.4 67.89,79.71 66.81,79.71 66.29,80.23 66.29,81.33 65.66,81.84 60.45,81.84 58.29,79.68 58.29,73.08 58.93,72.44 59.1,65.42 61.88,61.13 65.79,61.27
VCC_5V on Inner2: 22.1,71.93 39.12,88.95 39.12,94.24 37.17,96.19 27.57,86.59 22.92,86.59 18.92,82.6 18.92,74.47 21.02,72.38 22.29,72.38 22.1,72.18
VCC_5V on Inner2: 12.95,12.12 95,12.12 95,0.18 12.95,0.18
VCC_5V on Inner2: 37.07,96.19 58.93,96.19 58.93,94.03 37.07,94.03
VCC_5V on Inner2: 57.52,94.3 62.87,88.95 62.87,87.68 69.54,87.68 69.54,90.15 63.09,96.6 58.58,96.6 58.58,95.36
VCC_5V on Inner2: 100,56.33 100.52,55.8 101.73,55.8 101.73,51.87 101.09,51.23 101.09,47.85 94.61,39.11 94.49,12.01 89,6.52 85.06,10.47 80.01,10.47 80.01,37.52 98.43,55.93 99.15,55.93 99.44,56.31
VCC_5V on Inner2: 22.1,9.83 22.1,32.44 12.9,41.63 23.36,52.78 24.64,74.6 18.92,80.31 18.92,66.85 1.4,49.33 1.4,42.19 2.69,40.9 2.69,38.76 15.24,26.21 15.24,12.98 13,10.74 13.91,9.83
VCC_9V on Top Layer: 42.8,54.92 45.21,54.92 45.21,53.14 42.8,53.14
VCC_9V on Top Layer: 42.67,47.36 45.47,47.36 45.47,45.39 42.67,45.39
VCC_9V on Top Layer: 64.71,46.79 67.12,46.79 67.12,45.01 64.71,45.01
VCC_9V on Top Layer: 40.89,82.86 40.89,69.81 40.15,69.06 40.15,68.25 41.28,68.25 41.66,67.87 46.74,67.87 46.74,65.58 45.34,64.19 41.53,64.19 38.35,67.36 38.35,68.12 36.64,69.84 36.64,76.06 35.43,77.27 35.43,81.84 36.45,82.86
VCC_9V on Top Layer: 64.37,54.56 67.17,54.56 67.17,52.59 64.37,52.59
VCC_9V on Inner2: 46.23,63.93 54.36,63.93 64.01,54.28 64.01,45.77 64.64,45.14 66.67,45.14 67.47,45.94 67.47,54.5 56.52,65.45 47.11,65.45 47.11,64.82
VCC_9V on Inner2: 42.54,64.69 45.47,64.69 45.47,45.26 42.54,45.26
VCC_9V on Inner2: 37.25,91.36 47.31,91.36 47.31,64.76 46.42,63.87 41.59,63.87 40,65.46 40,72.82 37.21,75.62 37.21,91.24 37.25,91.27
VCC_12V on Top Layer: 81.66,68 73.79,60.12 58.42,60.12 51.44,67.11 51.44,68.38 51.31,68.5 48.77,68.5 48.64,68.38 48.64,65.08 56.77,56.95 77.47,56.95 86.11,65.58 83.69,68
VCC_12V on Top Layer: 85.98,65.58 90.04,69.64 90.04,72.58 87.76,74.85 83.46,74.85 81.15,72.82 79.24,72.43 78.36,71.55 71.63,71.55 71.37,71.3 71.37,69.77 72.01,69.14 80.39,69.14 83.95,65.58
A1_L on Top Layer: 37.08,52.5 34.67,52.5 34.67,54.53 37.08,54.53
A1_L on Bottom Layer: 36.96,54.41 36.96,59.74 42.54,65.33 41.09,83.74 41.02,85.65 38.74,89.2 36.96,91.87 34.16,93.9 34.16,98.09 32.77,99.49 30.61,99.49 29.97,98.86 29.72,94.41 37.34,84.63 39.37,66.34 35.18,62.15 34.8,53.26 34.67,52.63 36.96,52.63 36.93,53.74 36.93,54.43 36.94,54.43
A1_R on Top Layer: 72.9,47.42 75.31,47.42 75.31,45.39 72.9,45.39
A1_R on Bottom Layer: 72.9,47.3 72.9,14.15 71.12,12.37 70.87,1.07 74.33,0.98 75.18,1.83 76.07,12.5 76.45,13.26 75.31,44.75 75.31,47.68
A2_L on Top Layer: 37.08,49.96 34.04,49.96 34.04,51.23 37.08,51.23
A2_L on Bottom Layer: 35.69,51.23 34.54,51.23 33.4,52.38 33.4,90.22 29.34,94.28 29.34,98.35 28.32,99.37 25.53,99.37 24.38,98.22 24.38,93.78 26.03,92.13 27.81,91.49 30.25,86.78 31.24,52.25 33.4,50.09 35.69,50.09
A2_R on Top Layer: 72.9,49.96 75.95,49.96 75.95,48.69 72.9,48.69
A2_R on Bottom Layer: 74.29,48.56 76.2,48.56 80.01,44.75 78.61,11.61 75.82,6.91 75.82,2.21 76.71,1.32 76.71,0.81 79.12,0.81 80.39,2.08 80.39,6.02 80.14,6.27 80.14,7.42 82.04,9.32 82.04,46.91 79.11,49.85 74,49.85 74,48.86
B1_L on Top Layer: 37.02,45.39 34.61,45.39 34.61,47.42 37.02,47.42
B1_L on Bottom Layer: 36.93,47.08 37.21,43.99 52.58,28.25 40,10.67 40,6.91 33.4,0.31 30.86,0.31 29.34,1.83 29.34,5.26 36.32,12.24 42.04,20.5 48.77,27.99 34.54,39.9 34.54,47.04 34.58,47.08
B1_R on Top Layer: 72.96,54.53 75.37,54.53 75.37,52.5 72.96,52.5
B1_R on Bottom Layer: 75.31,52.5 75.31,98.48 75.18,98.48 74.04,99.62 72.01,99.62 70.61,98.22 70.61,92.89 71.5,92 71.5,58.55 73.07,56.97 73.07,52.58 73.29,52.5
B2_L on Top Layer: 37.08,48.56 34.04,48.56 34.04,49.83 37.08,49.83
B2_L on Bottom Layer: 35.56,49.96 33.53,49.96 31.5,47.93 31.5,17.7 26.8,13 26.8,8.31 24.38,5.89 24.38,1.57 25.15,0.81 29.21,0.81 29.21,6.91 29.84,7.54 29.84,10.47 35.18,15.8 34.8,27.74 34.67,28.88 34.67,47.94 34.04,48.56 35.81,48.56 35.81,49.58 35.56,49.83
B2_R on Top Layer: 72.9,51.36 75.95,51.36 75.95,50.09 72.9,50.09
B2_R on Bottom Layer: 74.29,51.36 75.95,51.36 75.95,82.6 80.39,87.05 80.39,90.22 77.98,92.63 77.22,92.63 75.95,93.9 75.82,93.9 75.82,98.35 76.96,99.49 79.38,99.49 80.9,97.97 80.9,93.78 83.19,91.49 83.19,85.78 78.74,81.33 78.74,52.5 76.45,50.22 74.29,50.22
FR_BST on Top Layer: 70.99,72.19 71.37,71.81 71.37,69.65 72.39,68.63 72.39,67.61 71.75,66.98 70.74,66.98 70.11,67.61 70.11,71.97 70.32,72.17 70.32,72.19 71.12,72.19 71.12,72.19
$2N2089 on Top Layer: 69.93,69.15 69.92,69.12 69.92,66.46 70.11,66.27 70.87,66.27 71.5,65.63 71.5,62.03 70.87,61.39 68.33,61.39 67.44,62.28 67.44,65.96 68.2,66.73 68.2,68.76 68.83,69.39 68.83,71.93 69.09,72.19 69.85,72.19 69.9,72.13 69.98,72.13 69.98,69.1
$2N17034 on Top Layer: 49.53,69.39 50.93,69.39 50.93,70.66 51.18,70.92 51.18,73.46 52.83,75.11 52.83,82.47 51.82,83.49 48.39,83.49 47.37,82.47 47.37,76.5 49.15,74.73 49.15,71.17 49.53,70.79

Small or netless copper shapes (teardrops, artwork), in the pictures only: 3 on Top Layer, 2 on Bottom Layer

## Text on the board
Top Silkscreen Layer: PA0_IN0 / PA4 | PC8 / PD2_IN3 | RPI_29 | RST | DC | CS | SCK | DIN | GND | VCC | RPI_1 | RPI_4 | RPI_5 | TX | RX | 5V | TX0 | RX0 | RPI_6 | B2_L | A2_L | B1_L | A1_L | 9V | PC15 | PA7 | PC14 | PC4 | PC13 | PC5 | PB0 | PA5 | PB1 | PA6 | A1_R | B1_R | A2_R | B2_R | 3.3V | NC | RX3 | TX3 | PC7 | PC6 | PB15 | PB14 | PB13 | DIO | CLK | PA12_IN1 / PB12 | PC9 / PA15_IN2 | PC0 | PC2 | PC3 | PC1 | PA1 | designed by YYJ | PTGK | 跳帽树莓派上电 | SY指示灯 | 9855指示灯 | 12V指示灯 | RESET按钮 | 9V&3.3V / 开关 | 5V开关
